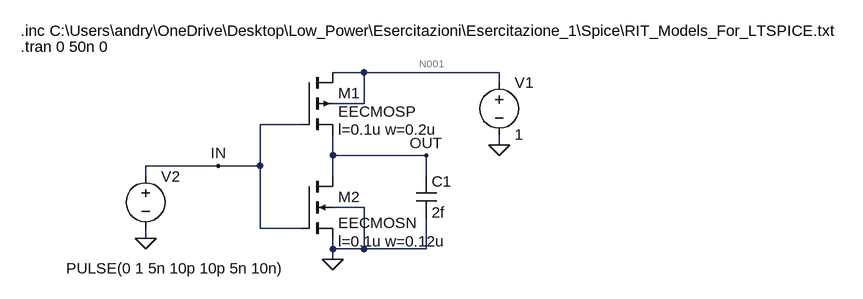
[diagram p0: schematic Esercitazione_1.asc]
Esercitazione_1.asc, the LTspice schematic file:
Version 4
SHEET 1 1172 680
WIRE 304 -16 256 -16
WIRE 512 -16 304 -16
WIRE 512 0 512 -16
WIRE 304 32 304 -16
WIRE 304 32 256 32
WIRE 208 64 144 64
WIRE 512 96 512 80
WIRE 256 112 256 80
WIRE 400 112 256 112
WIRE 80 128 -32 128
WIRE 144 128 144 64
WIRE 144 128 80 128
WIRE -32 144 -32 128
WIRE 256 144 256 112
WIRE 400 144 400 112
WIRE 304 192 256 192
WIRE 144 224 144 128
WIRE 208 224 144 224
WIRE -32 240 -32 224
WIRE 256 256 256 240
WIRE 304 256 304 192
WIRE 304 256 256 256
WIRE 400 256 400 208
WIRE 400 256 304 256
WIRE 256 272 256 256
FLAG 256 272 0
FLAG 512 96 0
FLAG -32 240 0
FLAG 80 128 IN
FLAG 400 112 OUT
SYMBOL cap 384 144 R0
SYMATTR InstName C1
SYMATTR Value 2f
SYMBOL pmos4 208 -16 R0
WINDOW 3 56 60 Left 2
WINDOW 123 56 88 Left 2
SYMATTR Value EECMOSP
SYMATTR Value2 l=0.1u w=0.2u
SYMATTR InstName M1
SYMBOL nmos4 208 144 R0
WINDOW 123 56 100 Left 2
SYMATTR Value2 l=0.1u w=0.12u
SYMATTR InstName M2
SYMATTR Value EECMOSN
SYMBOL voltage 512 -16 R0
WINDOW 123 0 0 Left 0
WINDOW 39 0 0 Left 0
SYMATTR InstName V1
SYMATTR Value 1
SYMBOL voltage -32 128 R0
WINDOW 3 -122 158 Left 2
WINDOW 123 0 0 Left 0
WINDOW 39 0 0 Left 0
SYMATTR Value PULSE(0 1 5n 10p 10p 5n 10n)
SYMATTR InstName V2
TEXT -224 -80 Left 2 !.inc C:\\Users\\andry\\OneDrive\\Desktop\\Low_Power\\Esercitazioni\\Esercitazione_1\\Spice\\RIT_Models_For_LTSPICE.txt
TEXT -224 -56 Left 2 !.tran 0 50n 0

The netlist it stands for:
* Esercitazione_1.asc
C1 OUT 0 2f
M1 N001 IN OUT N001 EECMOSP l=0.1u w=0.2u
M2 OUT IN 0 0 EECMOSN l=0.1u w=0.12u
V1 N001 0 1
V2 IN 0 PULSE(0 1 5n 10p 10p 5n 10n)
.model NMOS NMOS
.model PMOS PMOS
.lib standard.mos
.inc C:\Users\andry\OneDrive\Desktop\Low_Power\Esercitazioni\Esercitazione_1\Spice\RIT_Models_For_LTSPICE.txt
.tran 0 50n 0
.backanno
.end

* Results of the author's LTspice run, read from the files saved beside the schematic
* Operating Point, zero values left out:
*   V(out) = 999.9 mV
*   V(n001) = 1 V
*   Id(M2) = 6.593 nA
*   Ib(M2) = -1.01 pA
*   Is(M2) = -6.592 nA
*   Id(M1) = 6.593 nA
*   Is(M1) = -6.593 nA
*   I(V1) = -6.593 nA
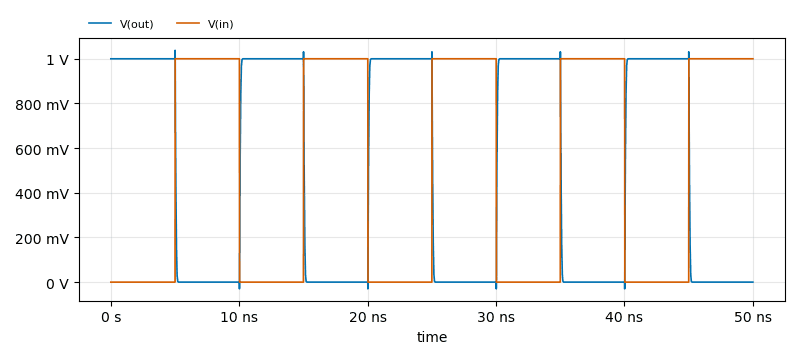
[diagram p1: Transient Analysis of Esercitazione_1.asc, plotted from the saved traces]
* Transient Analysis, 1 run:
*   V(out): min -29.9 mV, max 1.038 V, average 500.7 mV, rms 704.6 mV, last 60.69 µV
*   V(in): min 0 V, max 1 V, average 500.7 mV, rms 707.4 mV, last 1 V